# Altium schematic sheet STM32.SchDoc: Microcontroleur
size A4; Organization: Robocup Ulaval; DocumentNumber: 2; Revision: 1.0; SheetNumber: 2; SheetTotal: 10; Version: Gamma 1.0; Conceptor: Philippe T. Simon B. Léonard G. Alexia B-L.
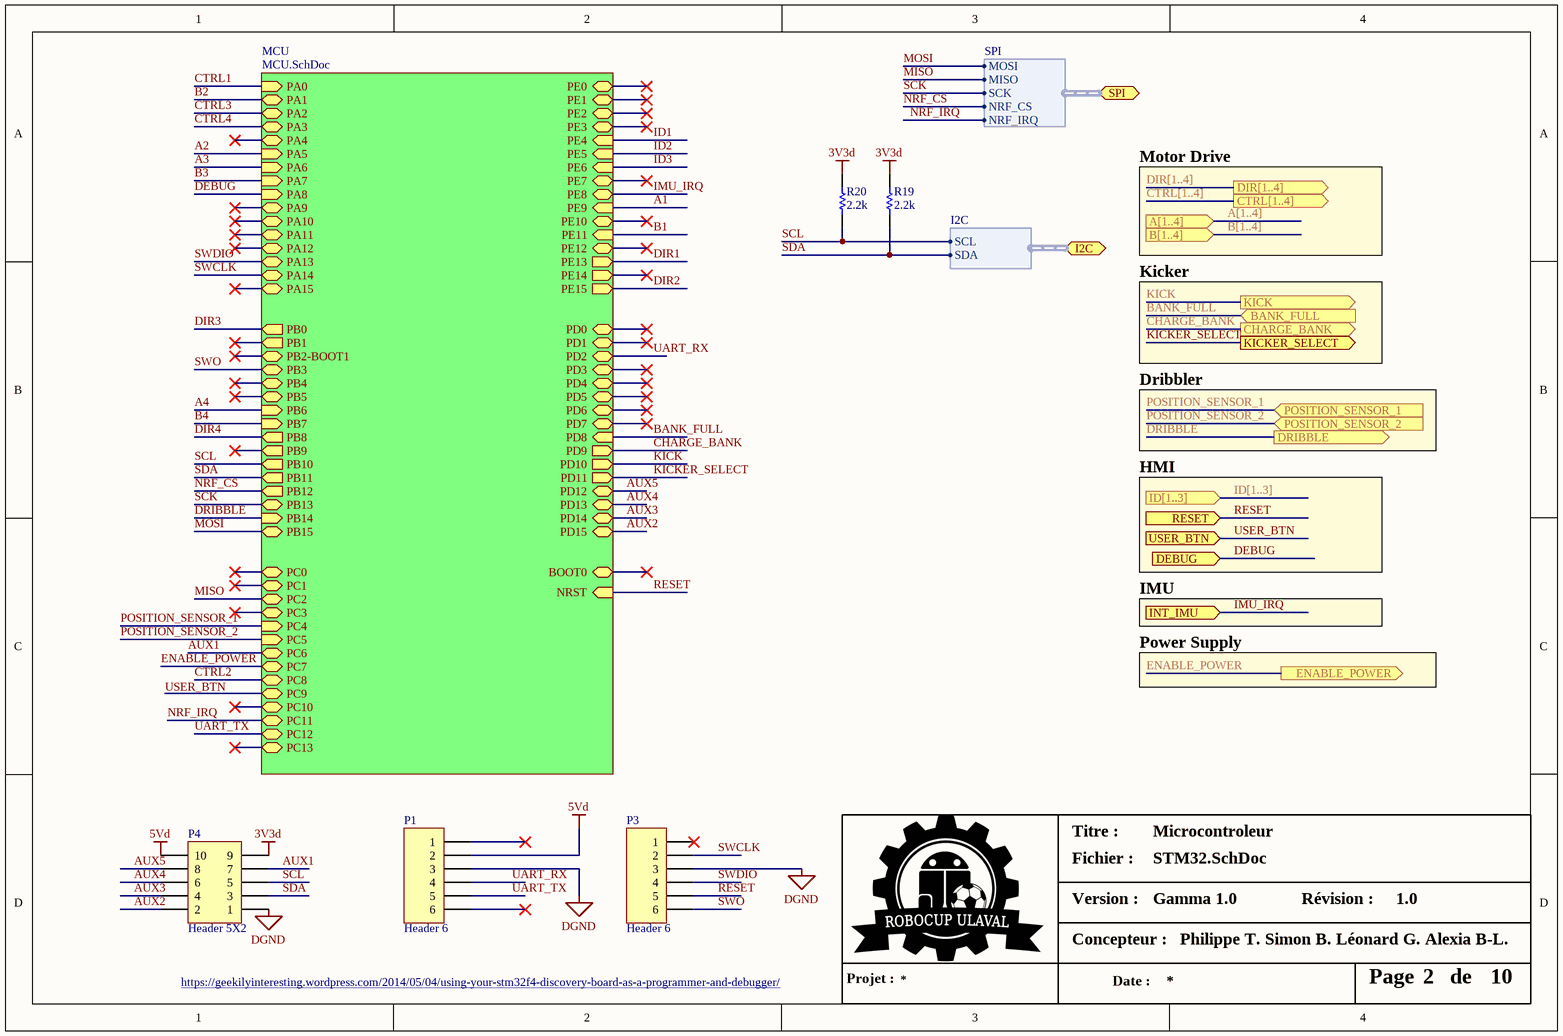
[diagram p0: STM32.SchDoc]

## Parts
P1  Header 6  [HDR1X6]
P3  Header 6  [HDR1X6]
P4  Header 5X2  [HDR2X5]
R19  Resistance (Ohms): 2.2k  [0603]  (hidden comment: RC0603FR-072K2L)
R20  Resistance (Ohms): 2.2k  [0603]  (hidden comment: RC0603FR-072K2L)

## Sub-sheets
MCU = MCU.SchDoc: PA0 (in), PA1, PA2, PA3, PA4, PA5 (in), PA6 (in), PA7 (in), PA8 (in), PA9, PA10, PA11, PA12, PA13, PA14, PA15, PB0 (out), PB1 (out), PB2-BOOT1, PB3, PB4, PB5, PB6 (in), PB7 (in), PB8 (out), PB9 (out), PB10 (out), PB11 (out), PB12 (out), PB13 (bidir), PB14 (in), PB15 (bidir), PC0, PC1, PC2 (bidir), PC3, PC4 (in), PC5 (in), PC6, PC7, PC8, PC9 (bidir), PC10, PC11, PC12, PC13, PE15 (out), PE14 (out), PE13 (out), PE12, PE11 (in), PE10, PE9 (in), PE8, PE7, PE6 (in), PE5 (in), PE4 (in), PE3, PE2, PE1, PE0, PD15, PD14, PD13, PD12, PD11 (out), PD10 (out), PD9 (out), PD8 (in), PD7, PD6, PD5, PD4, PD3, PD2, PD1, PD0, BOOT0, NRST (in)

## Ports
A[1..4] (in), B[1..4] (in), BANK_FULL (in), CHARGE_BANK (out), CTRL[1..4] (out), DEBUG (in), DIR[1..4] (out), DRIBBLE (out), ENABLE_POWER (out), I2C (harness I2C), ID[1..3] (in), INT_IMU (in), KICK (out), KICKER_SELECT (out), POSITION_SENSOR_1 (in), POSITION_SENSOR_2 (in), RESET (in), SPI (harness SPI), USER_BTN (in)

## Harnesses
I2C: SCL, SDA
SPI: MOSI, MISO, SCK, NRF_CS, NRF_IRQ

## Nets
3V3d: P4.9 R19.2 R20.2
5Vd: P1.2 P4.10
DGND: P1.3 P3.3 P4.1
A1: sheet MCU/PE9
A2: sheet MCU/PA5
A3: sheet MCU/PA6
A4: sheet MCU/PB6
AUX1: P4.7 ; sheet MCU/PC6
AUX2: P4.2 ; sheet MCU/PD15
AUX3: P4.4 ; sheet MCU/PD14
AUX4: P4.6 ; sheet MCU/PD13
AUX5: P4.8 ; sheet MCU/PD12
B1: sheet MCU/PE11
B2: sheet MCU/PA1
B3: sheet MCU/PA7
B4: sheet MCU/PB7
BANK_FULL: port BANK_FULL, sheet MCU/PD8
CHARGE_BANK: port CHARGE_BANK, sheet MCU/PD9
CTRL1: sheet MCU/PA0
CTRL2: sheet MCU/PC8
CTRL3: sheet MCU/PA2
CTRL4: sheet MCU/PA3
DEBUG: port DEBUG, sheet MCU/PA8
DIR1: sheet MCU/PE13
DIR2: sheet MCU/PE15
DIR3: sheet MCU/PB0
DIR4: sheet MCU/PB8
DRIBBLE: port DRIBBLE, sheet MCU/PB14
ENABLE_POWER: port ENABLE_POWER, sheet MCU/PC7
ID1: sheet MCU/PE4
ID2: sheet MCU/PE5
ID3: sheet MCU/PE6
IMU_IRQ: port INT_IMU, sheet MCU/PE8
KICK: port KICK, sheet MCU/PD10
KICKER_SELECT: port KICKER_SELECT, sheet MCU/PD11
MISO: sheet MCU/PC2, port SPI.MISO
MOSI: sheet MCU/PB15, port SPI.MOSI
NRF_CS: sheet MCU/PB12, port SPI.NRF_CS
NRF_IRQ: sheet MCU/PC11, port SPI.NRF_IRQ
POSITION_SENSOR_1: port POSITION_SENSOR_1, sheet MCU/PC4
POSITION_SENSOR_2: port POSITION_SENSOR_2, sheet MCU/PC5
RESET: P3.5 ; port RESET, sheet MCU/NRST
SCK: sheet MCU/PB13, port SPI.SCK
SCL: P4.5 R20.1 ; sheet MCU/PB10, port I2C.SCL
SDA: P4.3 R19.1 ; sheet MCU/PB11, port I2C.SDA
SWCLK: P3.2 ; sheet MCU/PA14
SWDIO: P3.4 ; sheet MCU/PA13
SWO: P3.6 ; sheet MCU/PB3
UART_RX: P1.4 ; sheet MCU/PD2
UART_TX: P1.5 ; sheet MCU/PC12
USER_BTN: port USER_BTN

Not connected (* = marked no-connect by the designer): P1 1* 6*; P3 1*

## Buses and harness runs
bus A[1..4] = port A[1..4]
bus B[1..4] = port B[1..4]
bus CTRL[1..4] = port CTRL[1..4]
bus DIR[1..4] = port DIR[1..4]
bus ID[1..3] = port ID[1..3]

## Notes on the sheet
- Motor Drive
- Kicker
- Dribbler
- HMI
- Power Supply
- IMU
- Titre :
- Version :
- Fichier :
- Révision :
- https://geekilyinteresting.wordpress.com/2014/05/04/using-your-stm32f4-discovery-board-as-a-programmer-and-debugger/
- Projet :
- Concepteur :
- Date :
- Page
- de
- Labels drawn without touching a wire or pin: USER_BTN

## Library data of the parts
P1 P3 = Header 6: Header, 6-Pin; LatestRevisionDate: 17-Jul-2002; LatestRevisionNote: Re-released for DXP Platform.; Publisher: Altium Limited
P4 = Header 5X2: Header, 5-Pin, Dual row; LatestRevisionDate: 17-Jul-2002; LatestRevisionNote: Re-released for DXP Platform.; Publisher: Altium Limited
R19 R20 = RC0603FR-072K2L: RES SMD 2.2K OHM 1% 1/10W 0603; Manufacturer: Yageo; Power (Watts): 0.1W, 1/10W; Temperature Coefficient: ±100ppm/°C; Supplier 1: Digi-Key; Manufacturer Part Number: RC0603FR-072K2L; RoHS: RoHS Compliant; Category: Resistors; Stock 1: 297758; Pricing 1: 1=0.15, 10=0.021, 25=0.0152, 100=0.0086, 250=0.0066, 500=0.00526, 1000=0.00389, 2500=0.00337 (CAD); Packaging: Cut Tape (CT); Tolerance: ±1%; Composition: Thick Film; Features: Moisture Resistant; Operating Temperature: -55°C ~ 155°C; Package / Case: 0603 (1608 Metric); Supplier Device Package: 0603; Size / Dimension: 0.063" L x 0.031" W (1.60mm x 0.80mm); Height: 0.022" (0.55mm); Number of Terminations: 2; ComponentLink1URL: http://www.yageo.com/documents/recent/PYu-RC_Group_51_RoHS_L_04.pdf; ComponentLink1Description: http://www.yageo.com/documents/recent/PYu-RC_Group_51_RoHS_L_04.pdf; Supplier Part Number 1: 311-2.20KHRCT-ND